# Altium schematic sheet tester_board.SchDoc: Overview
size A; Engineer: A. Peck; Organization: UCLA High Energy Physics; DocumentNumber: 1; Revision: 3.0; SheetNumber: 1; SheetTotal: 15; Project: LCT Comparator Tester
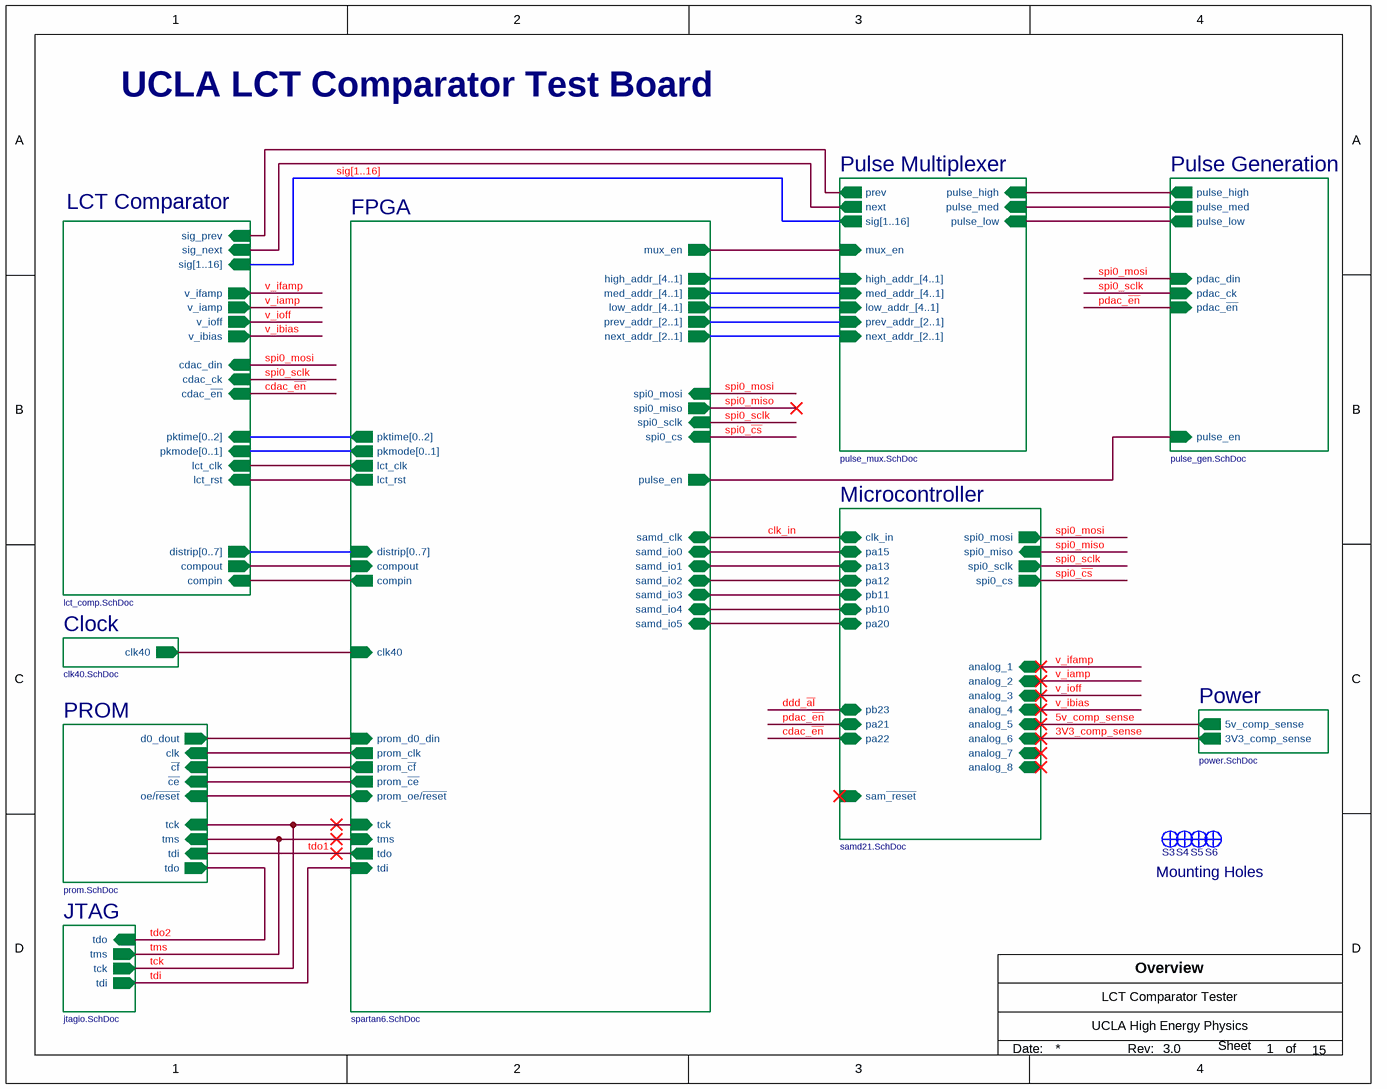
[diagram p0: tester_board.SchDoc]

## Parts
S3  STANDOFF #4  [STANDOFF #4]  (value not drawn)  (no BOM)
S4  STANDOFF #4  [STANDOFF #4]  (value not drawn)  (no BOM)
S5  STANDOFF #4  [STANDOFF #4]  (value not drawn)  (no BOM)
S6  STANDOFF #4  [STANDOFF #4]  (value not drawn)  (no BOM)

## Sub-sheets
Clock = clk40.SchDoc: clk40 (out)
FPGA = spartan6.SchDoc: pkmode[0..1] (out), distrip[0..7] (in), pktime[0..2] (out), lct_clk (out), lct_rst (out), compin (out), compout (in), tck (in), tdi (in), tdo (out), tms (in), prom_d0_din (in), prom_~{ce} (out), prom_~{cf} (out), prom_clk (out), prom_oe/~{reset} (bidir), clk40 (in), mux_en (out), high_addr_[4..1] (out), med_addr_[4..1] (out), low_addr_[4..1] (out), prev_addr_[2..1] (out), next_addr_[2..1] (out), spi0_miso (out), spi0_mosi (in), spi0_sclk (in), spi0_cs (in), pulse_en (out), samd_clk (bidir), samd_io1 (bidir), samd_io2 (bidir), samd_io3 (bidir), samd_io4 (bidir), samd_io0 (bidir), samd_io5 (bidir)
JTAG = jtagio.SchDoc: tck (out), tms (out), tdi (out), tdo (in)
LCT Comparator = lct_comp.SchDoc: sig[1..16] (in), pkmode[0..1] (in), distrip[0..7] (out), pktime[0..2] (in), lct_clk (in), lct_rst (in), compin (in), sig_prev (in), sig_next (in), v_ifamp (out), v_iamp (out), v_ioff (out), v_ibias (out), cdac_~{en} (in), cdac_din (in), cdac_ck (in), compout (out)
Microcontroller = samd21.SchDoc: pa15 (bidir), clk_in (bidir), pa13 (bidir), pa12 (bidir), pb11 (bidir), pb10 (bidir), pa20 (bidir), pb23 (bidir), analog_1 (bidir), analog_2 (bidir), analog_3 (bidir), analog_4 (bidir), analog_5 (bidir), analog_6 (bidir), analog_7 (bidir), analog_8 (bidir), spi0_miso (in), spi0_mosi (out), spi0_sclk (out), spi0_cs (out), sam~{_reset} (in), pa21 (bidir), pa22 (bidir)
Power = power.SchDoc: 3V3_comp_sense (out), 5v_comp_sense (out)
PROM = prom.SchDoc: d0_dout (out), tck (in), tdi (in), tdo (out), tms (in), clk (in), ~{ce} (in), oe/~{reset} (in), ~{cf} (in)
Pulse Generation = pulse_gen.SchDoc: pulse_en (in), pdac_~{en} (in), pdac_din (in), pdac_ck (in), pulse_high (out), pulse_med (out), pulse_low (out)
Pulse Multiplexer = pulse_mux.SchDoc: sig[1..16] (out), high_addr_[4..1] (in), med_addr_[4..1] (in), low_addr_[4..1] (in), prev (out), pulse_high (in), pulse_med (in), pulse_low (in), next (out), prev_addr_[2..1] (in), next_addr_[2..1] (in), mux_en (in)

## Nets
3V3_comp_sense: sheet Power/3V3_comp_sense, sheet Microcontroller/analog_6
5v_comp_sense: sheet Power/5v_comp_sense, sheet Microcontroller/analog_5
cdac_~{en}: sheet LCT Comparator/cdac_~{en}, sheet Microcontroller/pa22
clk_in: sheet FPGA/samd_clk, sheet Microcontroller/clk_in
ddd_~{al}: sheet Microcontroller/pb23
pdac_~{en}: sheet Pulse Generation/pdac_~{en}, sheet Microcontroller/pa21
spi0_~{cs}: sheet FPGA/spi0_cs, sheet Microcontroller/spi0_cs
spi0_miso: sheet FPGA/spi0_miso, sheet Microcontroller/spi0_miso
spi0_mosi: sheet LCT Comparator/cdac_din, sheet FPGA/spi0_mosi, sheet Pulse Generation/pdac_din, sheet Microcontroller/spi0_mosi
spi0_sclk: sheet LCT Comparator/cdac_ck, sheet FPGA/spi0_sclk, sheet Pulse Generation/pdac_ck, sheet Microcontroller/spi0_sclk
tck: sheet FPGA/tck, sheet PROM/tck, sheet JTAG/tck
tdi: sheet FPGA/tdi, sheet JTAG/tdi
tdo1: sheet FPGA/tdo, sheet PROM/tdi
tdo2: sheet PROM/tdo, sheet JTAG/tdo
tms: sheet FPGA/tms, sheet PROM/tms, sheet JTAG/tms
v_iamp: sheet LCT Comparator/v_iamp, sheet Microcontroller/analog_2
v_ibias: sheet LCT Comparator/v_ibias, sheet Microcontroller/analog_4
v_ifamp: sheet LCT Comparator/v_ifamp, sheet Microcontroller/analog_1
v_ioff: sheet LCT Comparator/v_ioff, sheet Microcontroller/analog_3
(unnamed): sheet LCT Comparator/lct_clk, sheet FPGA/lct_clk
(unnamed): sheet LCT Comparator/lct_rst, sheet FPGA/lct_rst
(unnamed): sheet LCT Comparator/compin, sheet FPGA/compin
(unnamed): sheet LCT Comparator/sig_prev, sheet Pulse Multiplexer/prev
(unnamed): sheet LCT Comparator/sig_next, sheet Pulse Multiplexer/next
(unnamed): sheet LCT Comparator/compout, sheet FPGA/compout
(unnamed): sheet FPGA/prom_d0_din, sheet PROM/d0_dout
(unnamed): sheet FPGA/prom_~{ce}, sheet PROM/~{ce}
(unnamed): sheet FPGA/prom_~{cf}, sheet PROM/~{cf}
(unnamed): sheet FPGA/prom_clk, sheet PROM/clk
(unnamed): sheet FPGA/prom_oe/~{reset}, sheet PROM/oe/~{reset}
(unnamed): sheet FPGA/clk40, sheet Clock/clk40
(unnamed): sheet FPGA/mux_en, sheet Pulse Multiplexer/mux_en
(unnamed): sheet FPGA/pulse_en, sheet Pulse Generation/pulse_en
(unnamed): sheet FPGA/samd_io1, sheet Microcontroller/pa13
(unnamed): sheet FPGA/samd_io2, sheet Microcontroller/pa12
(unnamed): sheet FPGA/samd_io3, sheet Microcontroller/pb11
(unnamed): sheet FPGA/samd_io4, sheet Microcontroller/pb10
(unnamed): sheet FPGA/samd_io0, sheet Microcontroller/pa15
(unnamed): sheet FPGA/samd_io5, sheet Microcontroller/pa20
(unnamed): sheet Pulse Generation/pulse_high, sheet Pulse Multiplexer/pulse_high
(unnamed): sheet Pulse Generation/pulse_med, sheet Pulse Multiplexer/pulse_med
(unnamed): sheet Pulse Generation/pulse_low, sheet Pulse Multiplexer/pulse_low

Not connected (* = marked no-connect by the designer): S3 1; S4 1; S5 1; S6 1

## Buses and harness runs
bus sheet FPGA/distrip[0..7] = sheet LCT Comparator/distrip[0..7]
bus sheet FPGA/high_addr_[4..1] = sheet Pulse Multiplexer/high_addr_[4..1]
bus sheet FPGA/low_addr_[4..1] = sheet Pulse Multiplexer/low_addr_[4..1]
bus sheet FPGA/med_addr_[4..1] = sheet Pulse Multiplexer/med_addr_[4..1]
bus sheet FPGA/next_addr_[2..1] = sheet Pulse Multiplexer/next_addr_[2..1]
bus sheet FPGA/pkmode[0..1] = sheet LCT Comparator/pkmode[0..1]
bus sheet FPGA/pktime[0..2] = sheet LCT Comparator/pktime[0..2]
bus sheet FPGA/prev_addr_[2..1] = sheet Pulse Multiplexer/prev_addr_[2..1]
bus sig[1..16] = sheet LCT Comparator/sig[1..16] = sheet Pulse Multiplexer/sig[1..16]

## Notes on the sheet
- UCLA LCT Comparator Test Board
- Mounting Holes
- Date:
- Rev:
- of
- Sheet

## Library data of the parts
S3-S6 = STANDOFF #4: Mounting Hole #4